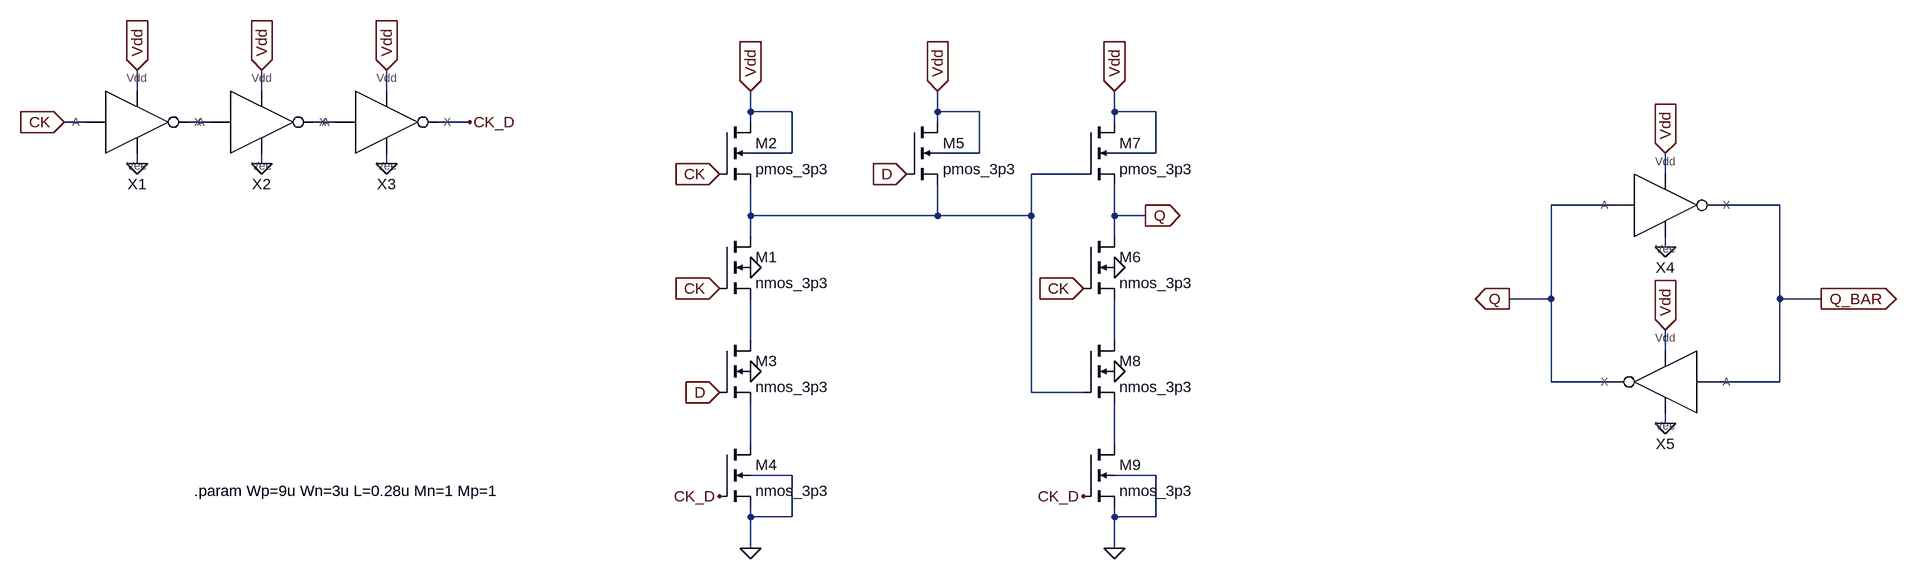
[diagram p0: schematic DFF_PULSED.asc]
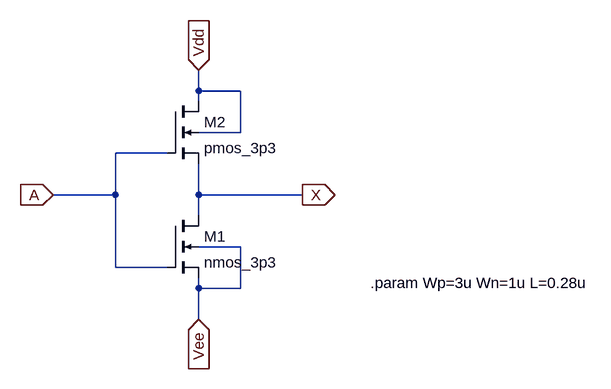
[diagram p1: sub-circuit invx1.asc]
DFF_PULSED.asc, the LTspice schematic file:
Version 4
SHEET 1 1776 680
WIRE -976 -80 -976 -112
WIRE -784 -80 -784 -112
WIRE -592 -80 -592 -112
WIRE -32 -48 -32 -80
WIRE 32 -48 -32 -48
WIRE 256 -48 256 -80
WIRE 320 -48 256 -48
WIRE 528 -48 528 -80
WIRE 592 -48 528 -48
WIRE -1056 -32 -1088 -32
WIRE -864 -32 -896 -32
WIRE -672 -32 -704 -32
WIRE -464 -32 -512 -32
WIRE -32 -32 -32 -48
WIRE 256 -32 256 -48
WIRE 528 -32 528 -48
WIRE 32 16 32 -48
WIRE 32 16 -32 16
WIRE 320 16 320 -48
WIRE 320 16 256 16
WIRE 592 16 592 -48
WIRE 592 16 528 16
WIRE -976 32 -976 16
WIRE -784 32 -784 16
WIRE -592 32 -592 16
WIRE 480 48 400 48
WIRE 1376 48 1376 16
WIRE 1296 96 1200 96
WIRE 1552 96 1456 96
WIRE -32 112 -32 64
WIRE 256 112 256 64
WIRE 256 112 -32 112
WIRE 400 112 400 48
WIRE 400 112 256 112
WIRE 528 112 528 64
WIRE 576 112 528 112
WIRE -32 144 -32 112
WIRE 528 144 528 112
WIRE 1376 160 1376 144
WIRE 1200 240 1200 96
WIRE 1200 240 1136 240
WIRE 1552 240 1552 96
WIRE 1616 240 1552 240
WIRE -32 304 -32 240
WIRE 528 304 528 240
WIRE 1376 320 1376 288
WIRE 1200 368 1200 240
WIRE 1296 368 1200 368
WIRE 1552 368 1552 240
WIRE 1552 368 1456 368
WIRE 400 384 400 112
WIRE 480 384 400 384
WIRE 1376 432 1376 416
WIRE -32 464 -32 400
WIRE 528 464 528 400
WIRE 32 512 -32 512
WIRE 592 512 528 512
WIRE -32 576 -32 560
WIRE 32 576 32 512
WIRE 32 576 -32 576
WIRE 528 576 528 560
WIRE 592 576 592 512
WIRE 592 576 528 576
WIRE -32 624 -32 576
WIRE 528 624 528 576
FLAG -32 -80 Vdd
IOPIN -32 -80 In
FLAG 256 -80 Vdd
IOPIN 256 -80 In
FLAG 528 -80 Vdd
IOPIN 528 -80 In
FLAG -80 48 CK
IOPIN -80 48 In
FLAG -80 224 CK
IOPIN -80 224 In
FLAG 480 224 CK
IOPIN 480 224 In
FLAG -32 624 0
FLAG 528 624 0
FLAG 208 48 D
IOPIN 208 48 In
FLAG -80 384 D
IOPIN -80 384 In
FLAG -976 32 0
FLAG -784 32 0
FLAG -592 32 0
FLAG -976 -112 Vdd
IOPIN -976 -112 In
FLAG -784 -112 Vdd
IOPIN -784 -112 In
FLAG -592 -112 Vdd
IOPIN -592 -112 In
FLAG -1088 -32 CK
IOPIN -1088 -32 In
FLAG -464 -32 CK_D
FLAG -80 544 CK_D
FLAG 480 544 CK_D
FLAG 1376 160 0
FLAG 1376 432 0
FLAG 1376 16 Vdd
IOPIN 1376 16 In
FLAG 1376 288 Vdd
IOPIN 1376 288 In
FLAG 576 112 Q
IOPIN 576 112 Out
FLAG 1136 240 Q
IOPIN 1136 240 Out
FLAG 1616 240 Q_BAR
IOPIN 1616 240 Out
FLAG -32 352 0
FLAG -32 192 0
FLAG 528 192 0
FLAG 528 352 0
SYMBOL nmos4 -80 144 R0
SYMATTR InstName M1
SYMATTR Value nmos_3p3
SYMATTR Value2 l={L} w={Wn} m={Mn}
SYMBOL nmos4 -80 -32 R0
SYMATTR InstName M2
SYMATTR Value pmos_3p3
SYMATTR Value2 l={L} w={Wp} m={Mp}
SYMBOL nmos4 -80 304 R0
SYMATTR InstName M3
SYMATTR Value nmos_3p3
SYMATTR Value2 l={L} w={Wn} m={Mn}
SYMBOL nmos4 -80 464 R0
SYMATTR InstName M4
SYMATTR Value nmos_3p3
SYMATTR Value2 l={L} w={Wn} m={Mn}
SYMBOL nmos4 208 -32 R0
SYMATTR InstName M5
SYMATTR Value pmos_3p3
SYMATTR Value2 l={L} w={Wp} m={Mp}
SYMBOL nmos4 480 144 R0
SYMATTR InstName M6
SYMATTR Value nmos_3p3
SYMATTR Value2 l={L} w={Wn} m={Mn}
SYMBOL nmos4 480 -32 R0
SYMATTR InstName M7
SYMATTR Value pmos_3p3
SYMATTR Value2 l={L} w={Wp} m={Mp}
SYMBOL nmos4 480 304 R0
SYMATTR InstName M8
SYMATTR Value nmos_3p3
SYMATTR Value2 l={L} w={Wn} m={Mn}
SYMBOL nmos4 480 464 R0
SYMATTR InstName M9
SYMATTR Value nmos_3p3
SYMATTR Value2 l={L} w={Wn} m={Mn}
SYMBOL INVx1 -976 -32 R0
SYMATTR InstName X1
SYMBOL INVx1 -784 -32 R0
SYMATTR InstName X2
SYMBOL INVx1 -592 -32 R0
SYMATTR InstName X3
SYMBOL INVx1 1376 96 R0
SYMATTR InstName X4
SYMBOL INVx1 1376 368 M0
SYMATTR InstName X5
TEXT -888 536 Left 2 !.param Wp=9u Wn=3u L=0.28u Mn=1 Mp=1

invx1.asc, the sub-circuit schematic file:
Version 4
SHEET 1 2776 836
WIRE 416 -16 416 -48
WIRE 480 -16 416 -16
WIRE 416 0 416 -16
WIRE 480 48 480 -16
WIRE 480 48 416 48
WIRE 368 80 288 80
WIRE 288 144 288 80
WIRE 288 144 192 144
WIRE 416 144 416 96
WIRE 576 144 416 144
WIRE 416 176 416 144
WIRE 480 224 416 224
WIRE 288 256 288 144
WIRE 368 256 288 256
WIRE 416 288 416 272
WIRE 480 288 480 224
WIRE 480 288 416 288
WIRE 416 336 416 288
FLAG 416 -48 Vdd
IOPIN 416 -48 In
FLAG 192 144 A
IOPIN 192 144 In
FLAG 576 144 X
IOPIN 576 144 Out
FLAG 416 336 Vee
IOPIN 416 336 In
SYMBOL nmos4 368 176 R0
SYMATTR InstName M1
SYMATTR Value nmos_3p3
SYMATTR Value2 l={L} w={Wn}
SYMBOL nmos4 368 0 R0
SYMATTR InstName M2
SYMATTR Value pmos_3p3
SYMATTR Value2 l={L} w={Wp}
TEXT 680 280 Left 2 !.param Wp=3u Wn=1u L=0.28u

The netlist it stands for:
* DFF_PULSED.asc
M1 N003 CK N004 0 nmos_3p3 l={L} w={Wn} m={Mn}
M2 Vdd CK N003 Vdd pmos_3p3 l={L} w={Wp} m={Mp}
M3 N004 D N006 0 nmos_3p3 l={L} w={Wn} m={Mn}
M4 N006 CK_D 0 0 nmos_3p3 l={L} w={Wn} m={Mn}
M5 Vdd D N003 Vdd pmos_3p3 l={L} w={Wp} m={Mp}
M6 Q CK N005 0 nmos_3p3 l={L} w={Wn} m={Mn}
M7 Vdd N003 Q Vdd pmos_3p3 l={L} w={Wp} m={Mp}
M8 N005 N003 N007 0 nmos_3p3 l={L} w={Wn} m={Mn}
M9 N007 CK_D 0 0 nmos_3p3 l={L} w={Wn} m={Mn}
XX1 CK Vdd N001 0 invx1
XX2 N001 Vdd N002 0 invx1
XX3 N002 Vdd CK_D 0 invx1
XX4 Q Vdd Q_BAR 0 invx1
XX5 Q_BAR Vdd Q 0 invx1

* block symbol definitions
.subckt invx1 A Vdd X Vee
M1 X A Vee Vee nmos_3p3 l={L} w={Wn}
M2 Vdd A X Vdd pmos_3p3 l={L} w={Wp}
.param Wp=3u Wn=1u L=0.28u
.ends invx1

.model NMOS NMOS
.model PMOS PMOS
.lib standard.mos
.param Wp=9u Wn=3u L=0.28u Mn=1 Mp=1
.backanno
.end